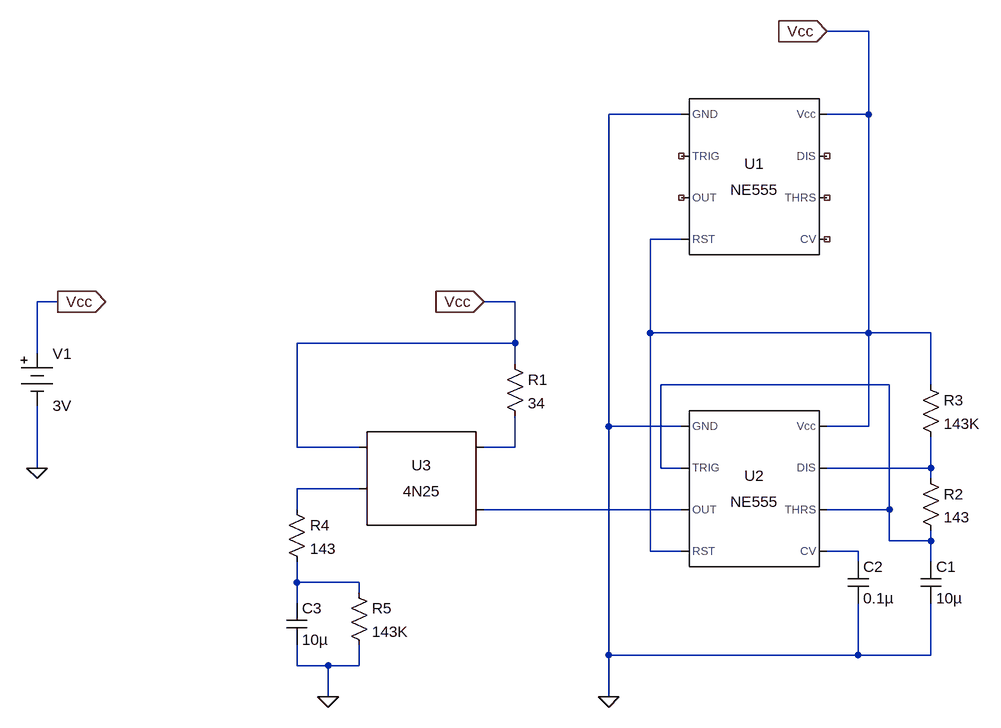
[diagram p0: schematic Pendant.asc]
Pendant.asc, the LTspice schematic file:
Version 4
SHEET 1 880 1028
WIRE 384 -48 320 -48
WIRE 96 80 -16 80
WIRE 384 80 384 -48
WIRE 384 80 320 80
WIRE 96 272 48 272
WIRE -864 368 -896 368
WIRE -160 368 -208 368
WIRE 48 416 48 272
WIRE 384 416 384 80
WIRE 384 416 48 416
WIRE 480 416 384 416
WIRE -160 432 -160 368
WIRE -160 432 -496 432
WIRE -896 448 -896 368
WIRE -160 464 -160 432
WIRE 416 496 64 496
WIRE 480 496 480 416
WIRE -16 560 -16 80
WIRE 96 560 -16 560
WIRE 384 560 384 416
WIRE 384 560 320 560
WIRE -496 592 -496 432
WIRE -400 592 -496 592
WIRE -160 592 -160 544
WIRE -160 592 -208 592
WIRE -896 624 -896 528
WIRE 64 624 64 496
WIRE 96 624 64 624
WIRE 480 624 480 576
WIRE 480 624 320 624
WIRE 480 640 480 624
WIRE -400 656 -496 656
WIRE -496 688 -496 656
WIRE 96 688 -208 688
WIRE 416 688 416 496
WIRE 416 688 320 688
WIRE 416 736 416 688
WIRE 480 736 480 720
WIRE 480 736 416 736
WIRE 48 752 48 416
WIRE 96 752 48 752
WIRE 368 752 320 752
WIRE 368 768 368 752
WIRE 480 768 480 736
WIRE -496 800 -496 768
WIRE -400 800 -496 800
WIRE -400 816 -400 800
WIRE -496 832 -496 800
WIRE -16 912 -16 560
WIRE 368 912 368 832
WIRE 368 912 -16 912
WIRE 480 912 480 832
WIRE 480 912 368 912
WIRE -496 928 -496 896
WIRE -448 928 -496 928
WIRE -400 928 -400 896
WIRE -400 928 -448 928
WIRE -448 976 -448 928
WIRE -16 976 -16 912
FLAG -16 976 0
FLAG -864 368 Vcc
IOPIN -864 368 Out
FLAG -896 624 0
FLAG 320 -48 Vcc
IOPIN 320 -48 In
FLAG -208 368 Vcc
IOPIN -208 368 In
FLAG -448 976 0
SYMBOL Misc\\NE555 208 176 R0
SYMATTR InstName U1
SYMBOL Misc\\NE555 208 656 R0
SYMATTR InstName U2
SYMBOL Optos\\4N25 -304 656 M0
SYMATTR InstName U3
SYMBOL Misc\\battery -896 432 R0
WINDOW 123 0 0 Left 0
WINDOW 39 0 0 Left 0
SYMATTR InstName V1
SYMATTR Value 3V
SYMBOL res -176 448 R0
SYMATTR InstName R1
SYMATTR Value 34
SYMATTR SpiceLine tol=1 pwr=0.1
SYMBOL res 464 624 R0
SYMATTR InstName R2
SYMATTR Value 143
SYMATTR SpiceLine tol=1 pwr=0.1
SYMBOL res 464 480 R0
SYMATTR InstName R3
SYMATTR Value 143K
SYMATTR SpiceLine tol=1 pwr=0.1
SYMBOL cap 464 768 R0
SYMATTR InstName C1
SYMATTR Value 10µ
SYMATTR SpiceLine V=10 Irms=0 Rser=0 Lser=0 mfg="Murata" pn="GRM188R61A106KE69" type="X5R"
SYMBOL cap 352 768 R0
SYMATTR InstName C2
SYMATTR Value 0.1µ
SYMATTR SpiceLine V=10 Irms=4.04 Rser=0.0357547 Lser=0 mfg="KEMET" pn="C0402C104K8RAC" type="X7R"
SYMBOL res -512 672 R0
SYMATTR InstName R4
SYMATTR Value 143
SYMATTR SpiceLine tol=1 pwr=0.1
SYMBOL cap -512 832 R0
SYMATTR InstName C3
SYMATTR Value 10µ
SYMATTR SpiceLine V=10 Irms=0 Rser=0 Lser=0 mfg="Murata" pn="GRM188R61A106KE69" type="X5R"
SYMBOL res -416 800 R0
SYMATTR InstName R5
SYMATTR Value 143K
SYMATTR SpiceLine tol=1 pwr=0.1

The netlist it stands for:
* Pendant.asc
XU1 0 NC_01 NC_02 Vcc NC_03 NC_04 NC_05 Vcc NE555  ; pins GND TRIG OUT RST CV THRS DIS Vcc
XU2 0 N001 N005 Vcc N006 N001 N003 Vcc NE555  ; pins GND TRIG OUT RST CV THRS DIS Vcc
XU3 N002 N005 Vcc N004 NC_06 4N25
V1 Vcc 0 3V
R1 Vcc N002 34 tol=1 pwr=0.1
R2 N003 N001 143 tol=1 pwr=0.1
R3 Vcc N003 143K tol=1 pwr=0.1
C1 N001 0 10µ V=10 Irms=0 Rser=0 Lser=0 mfg="Murata" pn="GRM188R61A106KE69" type="X5R"
C2 N006 0 0.1µ V=10 Irms=4.04 Rser=0.0357547 Lser=0 mfg="KEMET" pn="C0402C104K8RAC" type="X7R"
R4 N004 N007 143 tol=1 pwr=0.1
C3 N007 0 10µ V=10 Irms=0 Rser=0 Lser=0 mfg="Murata" pn="GRM188R61A106KE69" type="X5R"
R5 N007 0 143K tol=1 pwr=0.1
.lib NE555.sub
.lib 4N25.sub
.backanno
.end